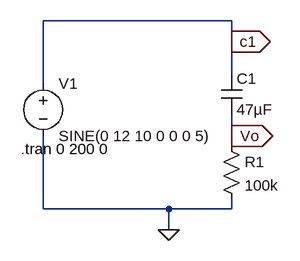
[diagram p0: schematic suggested_decoupling.asc]
suggested_decoupling.asc, the LTspice schematic file:
Version 4
SHEET 1 880 680
WIRE 352 0 64 0
WIRE 352 32 352 0
WIRE 352 80 352 32
WIRE 64 96 64 0
WIRE 352 176 352 144
WIRE 352 192 352 176
WIRE 64 288 64 176
WIRE 256 288 64 288
WIRE 352 288 352 272
WIRE 352 288 256 288
WIRE 256 320 256 288
FLAG 256 320 0
FLAG 352 176 Vo
IOPIN 352 176 Out
FLAG 352 32 c1
IOPIN 352 32 Out
SYMBOL voltage 64 80 R0
WINDOW 123 0 0 Left 2
WINDOW 39 0 0 Left 2
SYMATTR InstName V1
SYMATTR Value SINE(0 12 10 0 0 0 5)
SYMBOL cap 336 80 R0
SYMATTR InstName C1
SYMATTR Value 47µF
SYMBOL res 336 176 R0
SYMATTR InstName R1
SYMATTR Value 100k
TEXT 30 196 Left 2 !.tran 0 200 0

The netlist it stands for:
* suggested_decoupling.asc
V1 c1 0 SINE(0 12 10 0 0 0 5)
C1 c1 Vo 47µF
R1 Vo 0 100k
.tran 0 200 0
.backanno
.end